# EasyEDA schematic WVR_V1.json
TITLE: Sheet_1; REV: 1.0; Date: 2021-01-21; Sheet: 1/1; Company: Your Company
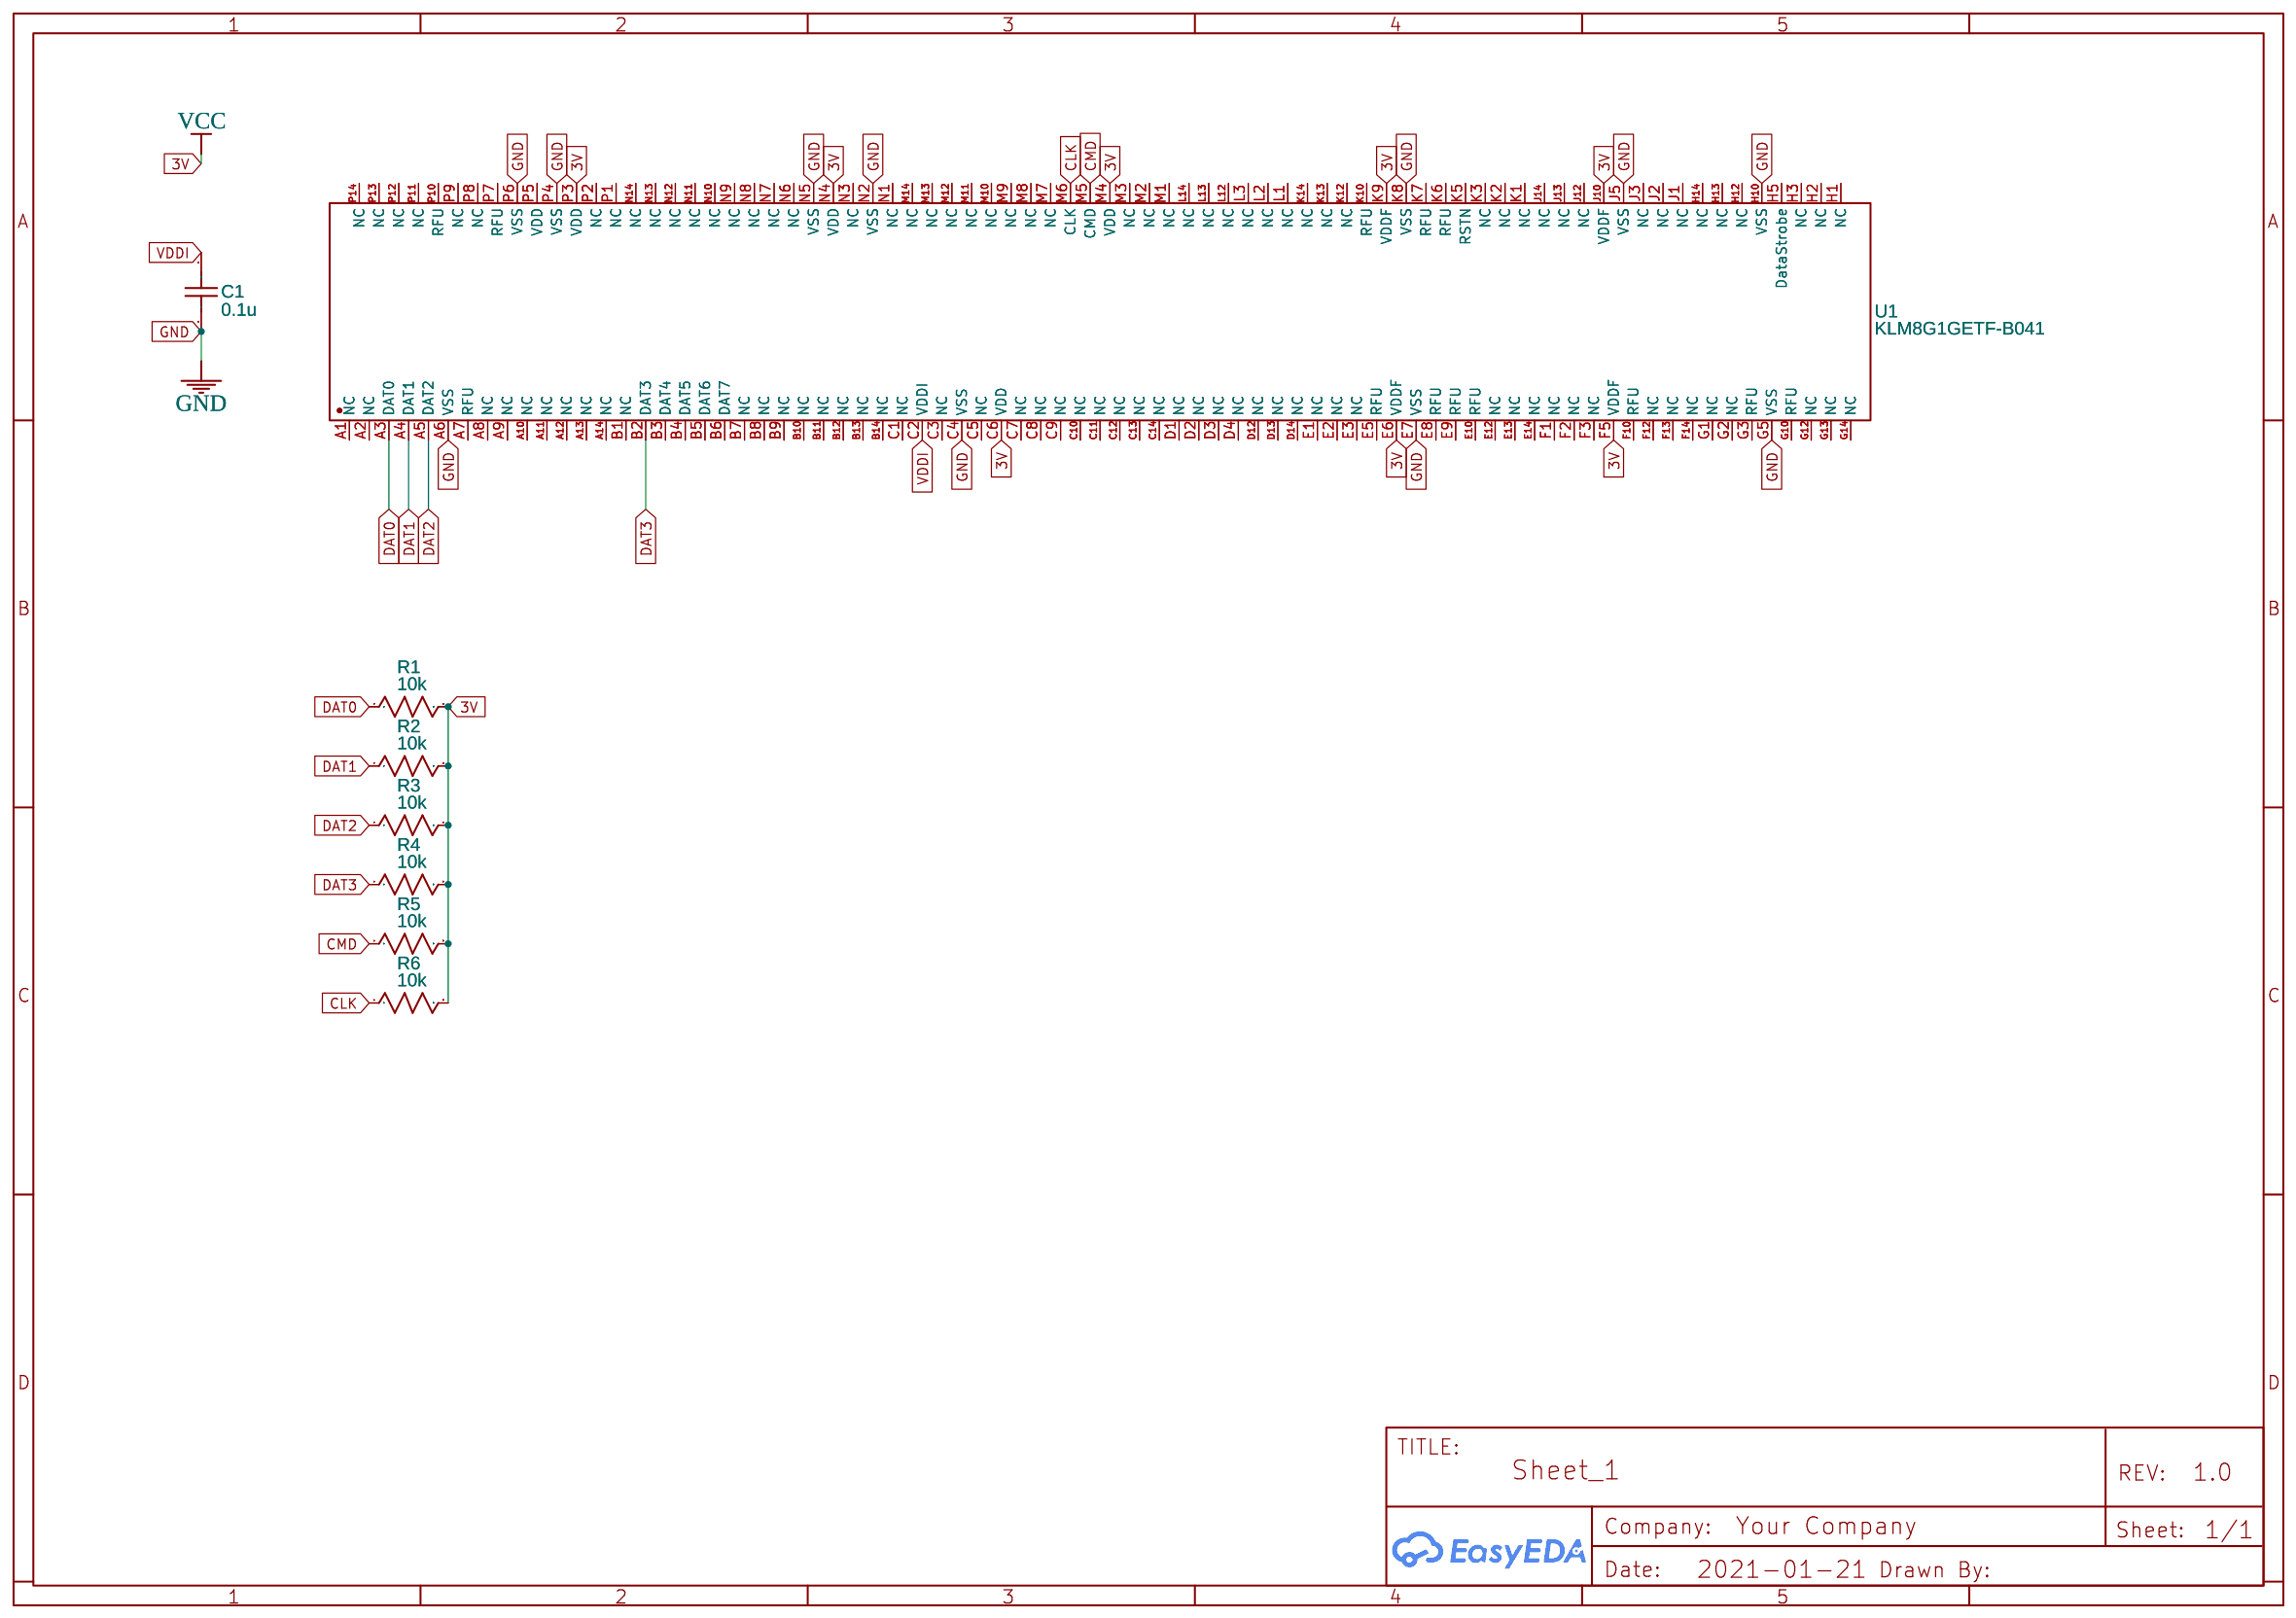
[diagram p0: schematic sheet]

## Parts
C1  0.1u  [C0402]
R1  10k  [R0402]
R2  10k  [R0402]
R3  10k  [R0402]
R4  10k  [R0402]
R5  10k  [R0402]
R6  10k  [R0402]
U1  KLM8G1GETF-B041  [FBGA-153_L13.0-W11.5-P0.50_KLMAG1JETD-B041]

## Library data of the parts
C1 = C_0402_US: Contributor: LCEDA_Lib
R1-R6 = R_0402_US: Contributor: LCEDA_Lib
U1 = KLM8G1GETF-B041: Supplier: LCSC; Supplier Part: C499918; Manufacturer: Samsung; Contributor: LCSC; SMT Type: Extend; JLCPCB SMD: Yes; LCSC Assembly: Yes

## Nets
3V: R1.2 R2.2 R3.2 R4.2 R5.2 R6.2 U1.C6(VDD) U1.E6(VDDF) U1.F5(VDDF) U1.J10(VDDF) U1.K9(VDDF) U1.M4(VDD) U1.N4(VDD) U1.P3(VDD)
GND: C1.1 U1.A6(VSS) U1.C4(VSS) U1.E7(VSS) U1.G5(VSS) U1.H10(VSS) U1.J5(VSS) U1.K8(VSS) U1.N2(VSS) U1.N5(VSS) U1.P4(VSS) U1.P6(VSS)
VDDI: C1.2 U1.C2(VDDI)
CLK: R6.1 U1.M6(CLK)
CMD: R5.1 U1.M5(CMD)
DAT0: R1.1 U1.A3(DAT0)
DAT1: R2.1 U1.A4(DAT1)
DAT2: R3.1 U1.A5(DAT2)
DAT3: R4.1 U1.B2(DAT3)

Not connected (* = marked no-connect by the designer): U1 A1(NC) A2(NC) A7(RFU) A8(NC) A9(NC) A10(NC) A11(NC) A12(NC) A13(NC) A14(NC) B1(NC) B3(DAT4) B4(DAT5) B5(DAT6) B6(DAT7) B7(NC) B8(NC) B9(NC) B10(NC) B11(NC) B12(NC) B13(NC) B14(NC) C1(NC) C3(NC) C5(NC) C7(NC) C8(NC) C9(NC) C10(NC) C11(NC) C12(NC) C13(NC) C14(NC) D1(NC) D2(NC) D3(NC) D4(NC) D12(NC) D13(NC) D14(NC) E1(NC) E2(NC) E3(NC) E5(RFU) E8(RFU) E9(RFU) E10(RFU) E12(NC) E13(NC) E14(NC) F1(NC) F2(NC) F3(NC) F10(RFU) F12(NC) F13(NC) F14(NC) G1(NC) G2(NC) G3(RFU) G10(RFU) G12(NC) G13(NC) G14(NC) H1(NC) H2(NC) H3(NC) H5(DataStrobe) H12(NC) H13(NC) H14(NC) J1(NC) J2(NC) J3(NC) J12(NC) J13(NC) J14(NC) K1(NC) K2(NC) K3(NC) K5(RSTN) K6(RFU) K7(RFU) K10(RFU) K12(NC) K13(NC) K14(NC) L1(NC) L2(NC) L3(NC) L12(NC) L13(NC) L14(NC) M1(NC) M2(NC) M3(NC) M7(NC) M8(NC) M9(NC) M10(NC) M11(NC) M12(NC) M13(NC) M14(NC) N1(NC) N3(NC) N6(NC) N7(NC) N8(NC) N9(NC) N10(NC) N11(NC) N12(NC) N13(NC) N14(NC) P1(NC) P2(NC) P5(VDD) P7(RFU) P8(NC) P9(NC) P10(RFU) P11(NC) P12(NC) P13(NC) P14(NC)
